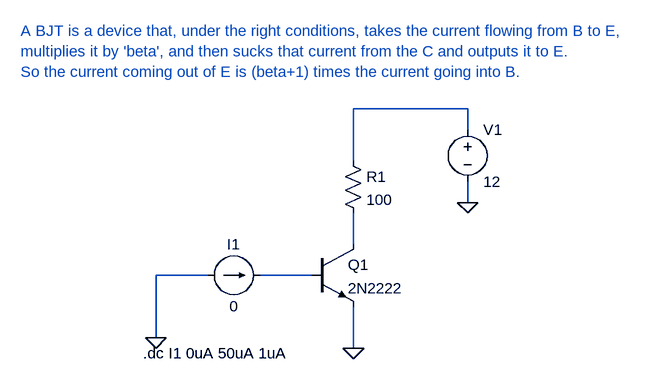
[diagram p0: schematic BaseBias01.asc]
BaseBias01.asc, the LTspice schematic file:
Version 4
SHEET 1 880 680
WIRE 368 -112 192 -112
WIRE 368 -80 368 -112
WIRE 192 -32 192 -112
WIRE 368 32 368 0
WIRE 192 96 192 48
WIRE -32 144 -112 144
WIRE 128 144 48 144
WIRE -112 240 -112 144
WIRE 192 256 192 192
FLAG 192 256 0
FLAG 368 32 0
FLAG -112 240 0
SYMBOL npn 128 96 R0
SYMATTR InstName Q1
SYMATTR Value 2N2222
SYMBOL res 176 -48 R0
SYMATTR InstName R1
SYMATTR Value 100
SYMBOL voltage 368 -96 R0
WINDOW 123 0 0 Left 0
WINDOW 39 0 0 Left 0
SYMATTR InstName V1
SYMATTR Value 12
SYMBOL current -32 144 R270
WINDOW 0 32 40 VTop 2
WINDOW 3 -32 40 VBottom 2
WINDOW 123 0 0 Left 0
WINDOW 39 0 0 Left 0
SYMATTR InstName I1
SYMATTR Value 0
TEXT -132 264 Left 2 !.dc I1 0uA 50uA 1uA
TEXT -320 -232 Left 2 ;A BJT is a device that, under the right conditions, takes the current flowing from B to E,\nmultiplies it by 'beta', and then sucks that current from the C and outputs it to E.\nSo the current coming out of E is (beta+1) times the current going into B.

The netlist it stands for:
* BaseBias01.asc
Q1 N002 N003 0 0 2N2222
R1 N001 N002 100
V1 N001 0 12
I1 0 N003 0
.model NPN NPN
.model PNP PNP
.lib standard.bjt
.dc I1 0uA 50uA 1uA
* A BJT is a device that, under the right conditions, takes the current flowing from B to E,
* multiplies it by 'beta', and then sucks that current from the C and outputs it to E.
* So the current coming out of E is (beta+1) times the current going into B.
.backanno
.end